# EAGLE schematic Schéma_projet_Pi3B+ (EAGLE 9.7.0)
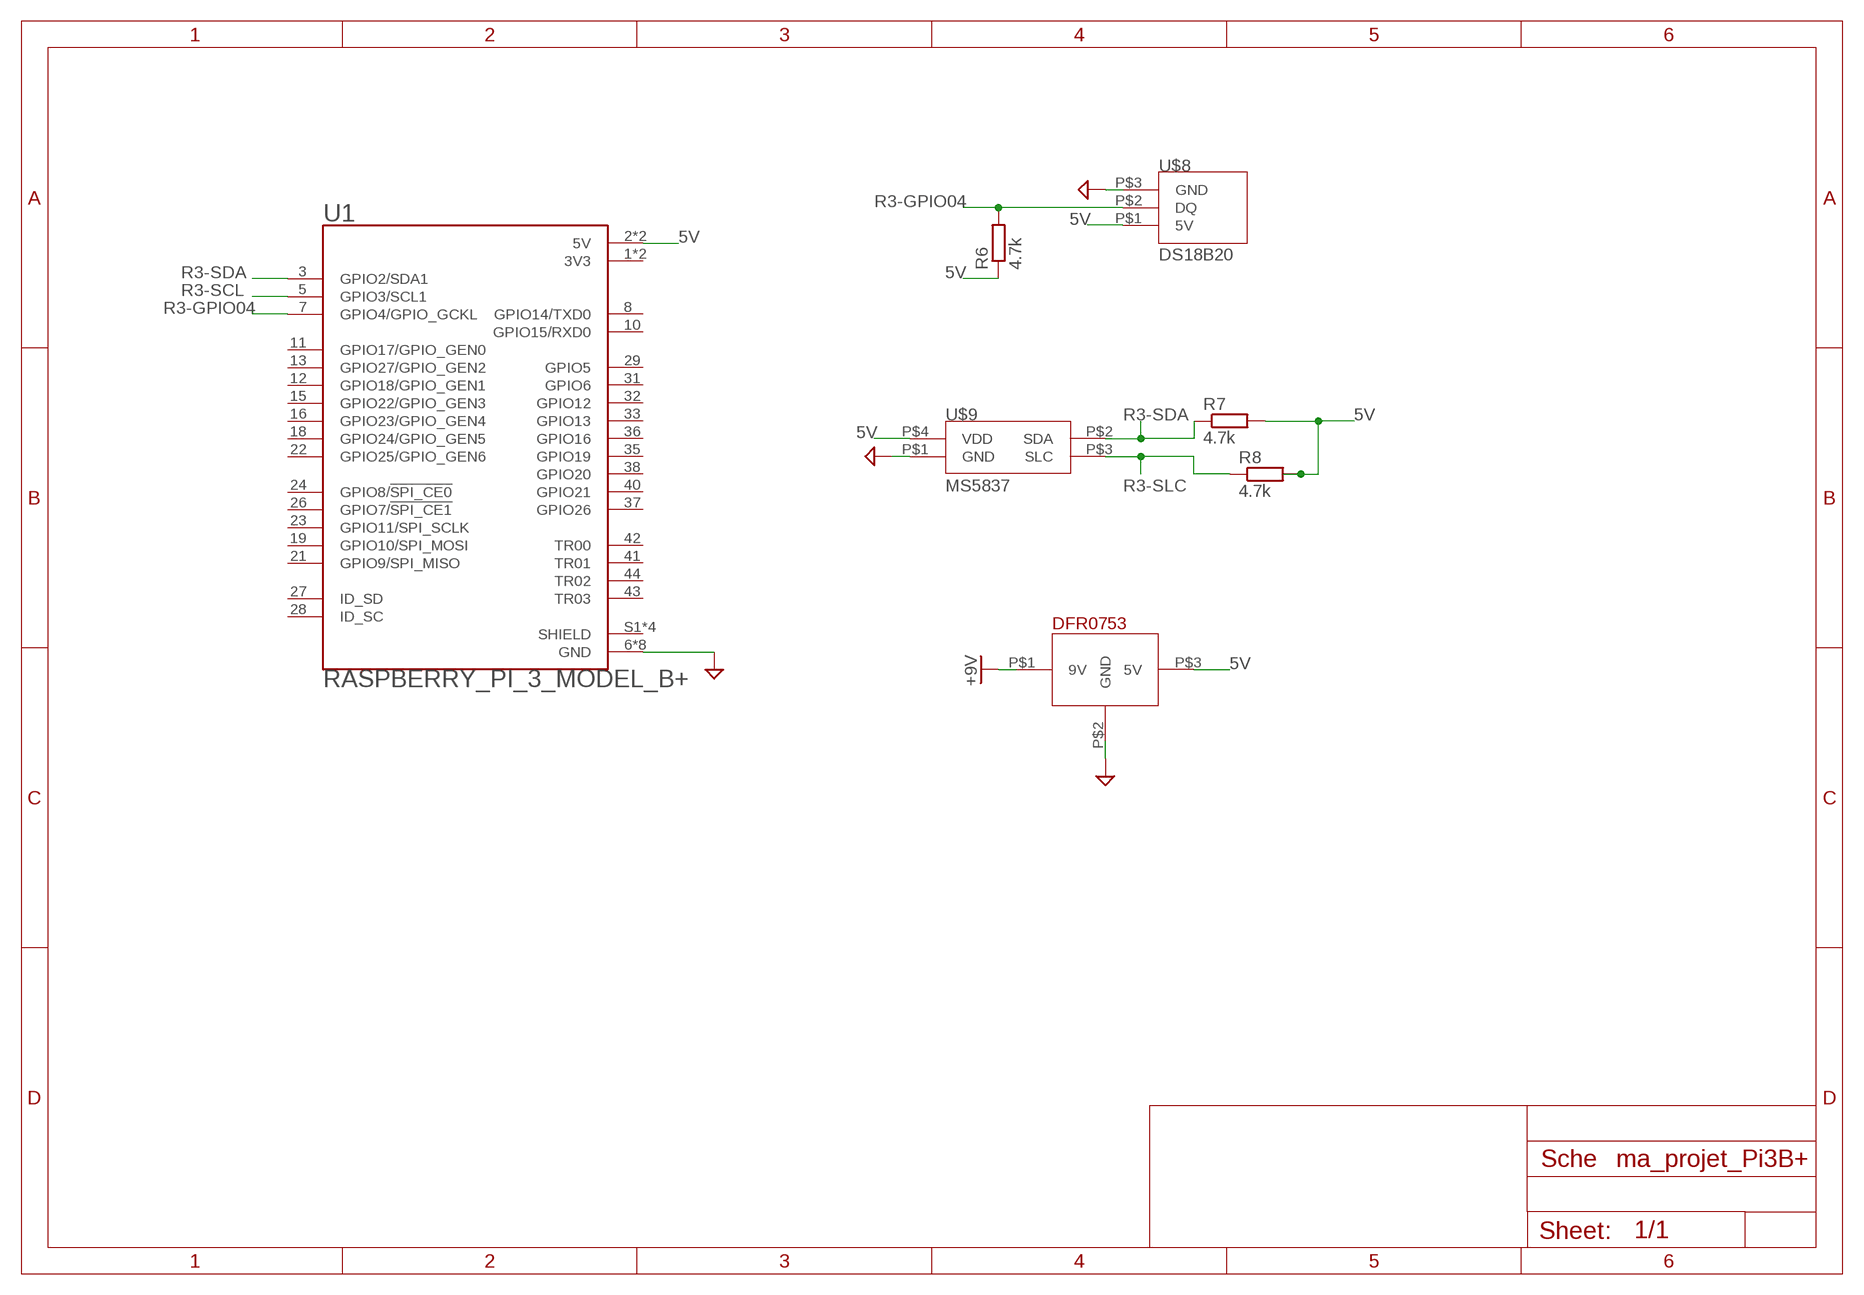
[diagram p0: schematic, sheet 1]

## Parts
R6  4.7k  R-EU_R0603  [R0603]
R7  4.7k  R-EU_R0603  [R0603]
R8  4.7k  R-EU_R0603  [R0603]
U1  RASPBERRY_PI_3_MODEL_B+  [MODULE_RASPBERRY_PI_3_MODEL_B+]
U$8  DS18B20  [DS18B20]
U$9  MS5837  [MS5837]
U$11  DFR0753  [DFR0753]

## Nets
5V: R6.1 R7.2 R8.2 U1.2(5V) U1.4(5V) U$8.P$1(5V) U$9.P$4(VDD) U$11.P$3(5V)
+9V: U$11.P$1(9V)
AGND: U1.6(GND) U1.9(GND) U1.14(GND) U1.20(GND) U1.25(GND) U1.30(GND) U1.34(GND) U1.39(GND) U$8.P$3(GND) U$9.P$1(GND) U$11.P$2(GND)
R3-GPIO04: R6.2 U1.7(GPIO4/GPIO_GCKL) U$8.P$2(DQ)
R3-SCL: U1.5(GPIO3/SCL1)
R3-SDA: R7.1 U1.3(GPIO2/SDA1) U$9.P$2(SDA)
R3-SLC: R8.1 U$9.P$3(SLC)
Unconnected: U1.8(GPIO14/TXD0) U1.10(GPIO15/RXD0) U1.11(GPIO17/GPIO_GEN0) U1.12(GPIO18/GPIO_GEN1) U1.13(GPIO27/GPIO_GEN2) U1.15(GPIO22/GPIO_GEN3) U1.16(GPIO23/GPIO_GEN4) U1.18(GPIO24/GPIO_GEN5) U1.19(GPIO10/SPI_MOSI) U1.21(GPIO9/SPI_MISO) U1.22(GPIO25/GPIO_GEN6) U1.23(GPIO11/SPI_SCLK) U1.24(GPIO8/!SPI_CE0!) U1.26(GPIO7/!SPI_CE1!) U1.27(ID_SD) U1.28(ID_SC) U1.29(GPIO5) U1.31(GPIO6) U1.32(GPIO12) U1.33(GPIO13) U1.35(GPIO19) U1.36(GPIO16) U1.37(GPIO26) U1.38(GPIO20) U1.40(GPIO21) U1.41(TR01) U1.42(TR00) U1.43(TR03) U1.44(TR02)

## Power pins joined to a net without a drawn wire
3V3: U1.1(3V3) U1.17(3V3)
SHIELD: U1.S1(SHIELD) U1.S2(SHIELD) U1.S3(SHIELD) U1.S4(SHIELD)

## Library data of the parts
R6-R8 = rcl:R-EU_: RESISTOR, European symbol; SPICEPREFIX: R
U1 = RASPBERRY_PI_3_MODEL_B_:RASPBERRY_PI_3_MODEL_B+; MANUFACTURER: Raspberry Pi; MAXIMUM_PACKAGE_HEIGHT: 16 mm; PARTREV: N/A; SNAPEDA_PN: RASPBERRY PI 3 MODEL B+; STANDARD: Manufacturer Recommendations
U$8 = Bibliothèque_3S04:DS18B20
U$9 = Bibliothèque_3S04:MS5837
U$11 = Bibliothèque:DFR0753